# Altium schematic sheet 02-REVISION.SchDoc
size 420 x 297 mm
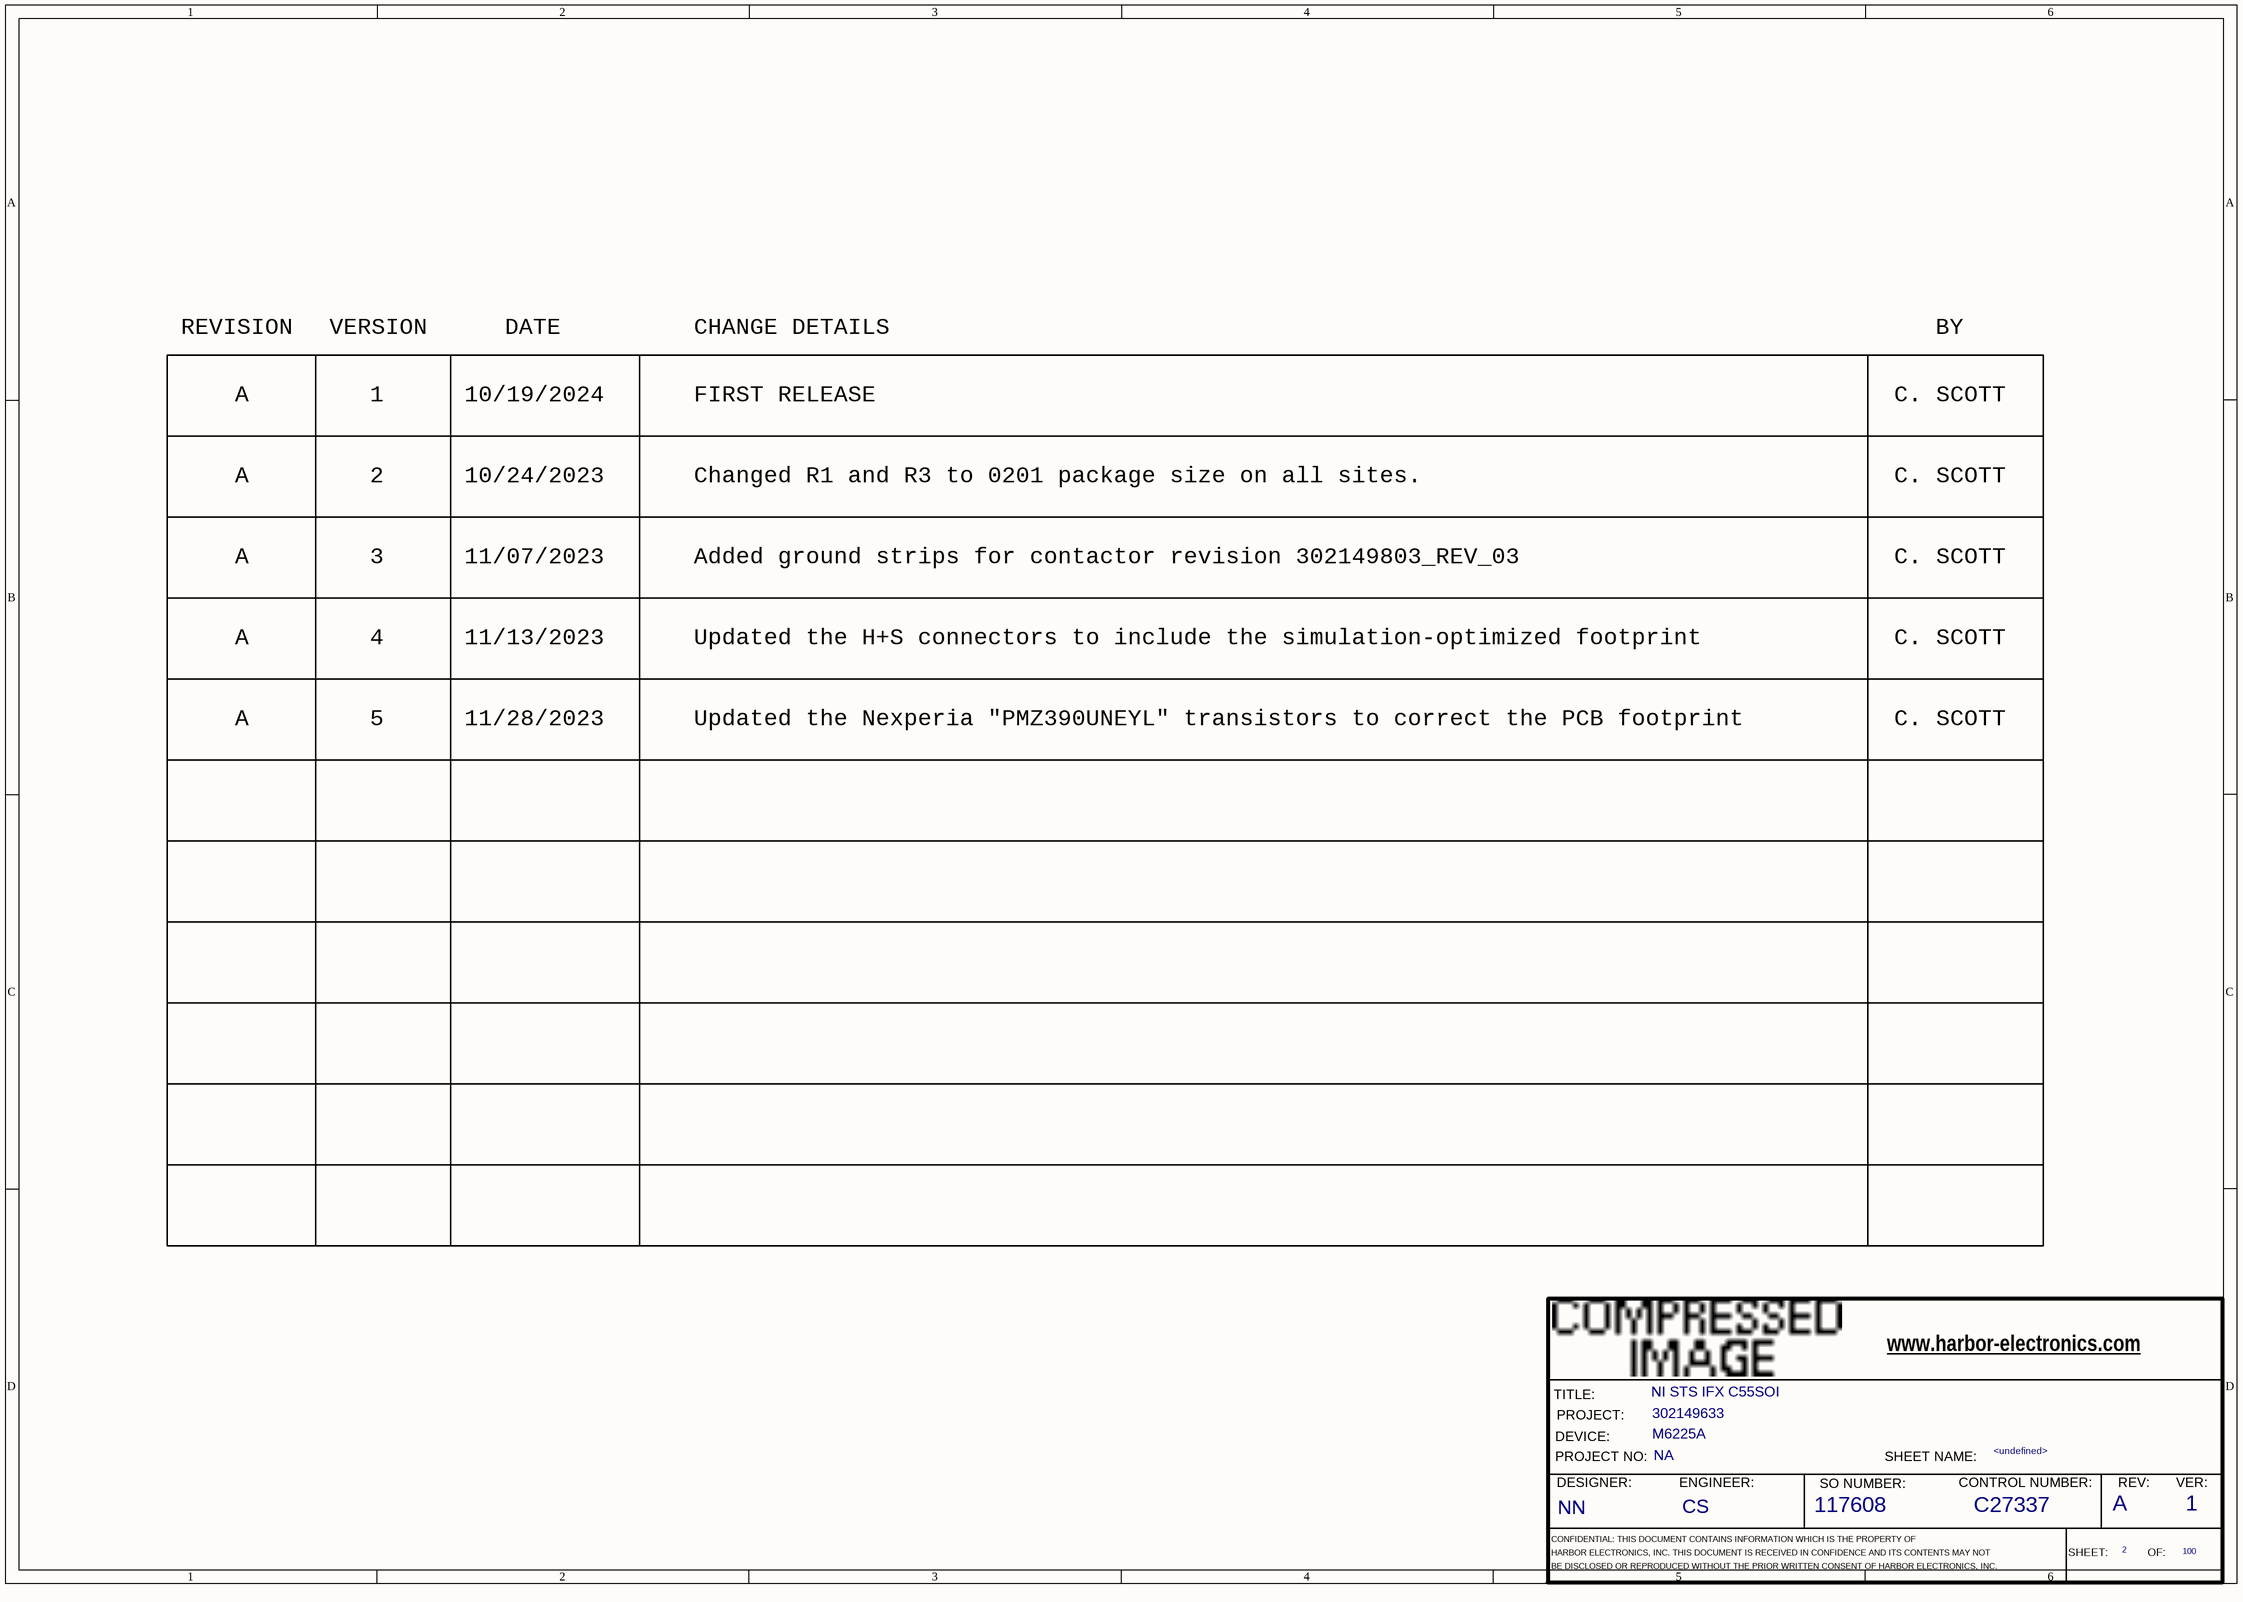
[diagram p0: 02-REVISION.SchDoc]

## Parts
*  RevCode: A  Title: NI STS IFX C55SOI  Page Number: 2  Page Count: 100  Engineer: CS  Designer: NN  SO Number: 117608  Control Number: C27337  Version: 1  Page Name: <undefined>  PROJECT: 302149633  DEVICE: M6225A  PROJECT NO.: NA  (hidden comment: HE_DEFAULT)  (graphical)

## Notes on the sheet
- REVISION
- VERSION
- DATE
- CHANGE DETAILS
- BY
- A
- 1
- 10/19/2024
- FIRST RELEASE
- C. SCOTT
- 2
- 10/24/2023
- Changed R1 and R3 to 0201 package size on all sites.
- 3
- 11/07/2023
- Added ground strips for contactor revision 302149803_REV_03
- 4
- 11/13/2023
- Updated the H+S connectors to include the simulation-optimized footprint
- 5
- 11/28/2023
- Updated the Nexperia "PMZ390UNEYL" transistors to correct the PCB footprint
- (in symbol HE_DEFAULT) www.harbor-electronics.com; TITLE:; PROJECT:; DEVICE:; PROJECT NO:; SHEET NAME:; DESIGNER:; ENGINEER:; CONTROL NUMBER:; REV:; VER:; SO NUMBER:; CONFIDENTIAL: THIS DOCUMENT CONTAINS INFORMATION WHICH IS THE PROPERTY OF; HARBOR ELECTRONICS, INC. THIS DOCUMENT IS RECEIVED IN CONFIDENCE AND ITS CONTENTS MAY NOT; SHEET:; OF:; BE DISCLOSED OR REPRODUCED WITHOUT THE PRIOR WRITTEN CONSENT OF HARBOR ELECTRONICS, INC.

## Library data of the parts
* = HE_DEFAULT: Page Size: X; OrgAddr4: Fax: +1 602-431-9633; OrgAddr1: 4050 E. Cotton Center Blvd., Suite 33; OrgAddr2: Phoenix, Arizona 85040 U.S.A.; OrgAddr3: Phone: +1 602-438-1112; Doc: <Title Name>; OrgName: HARBOR